# Altium schematic sheet pqm_v2_page1.SchDoc: Power Quality Monitor
size A4
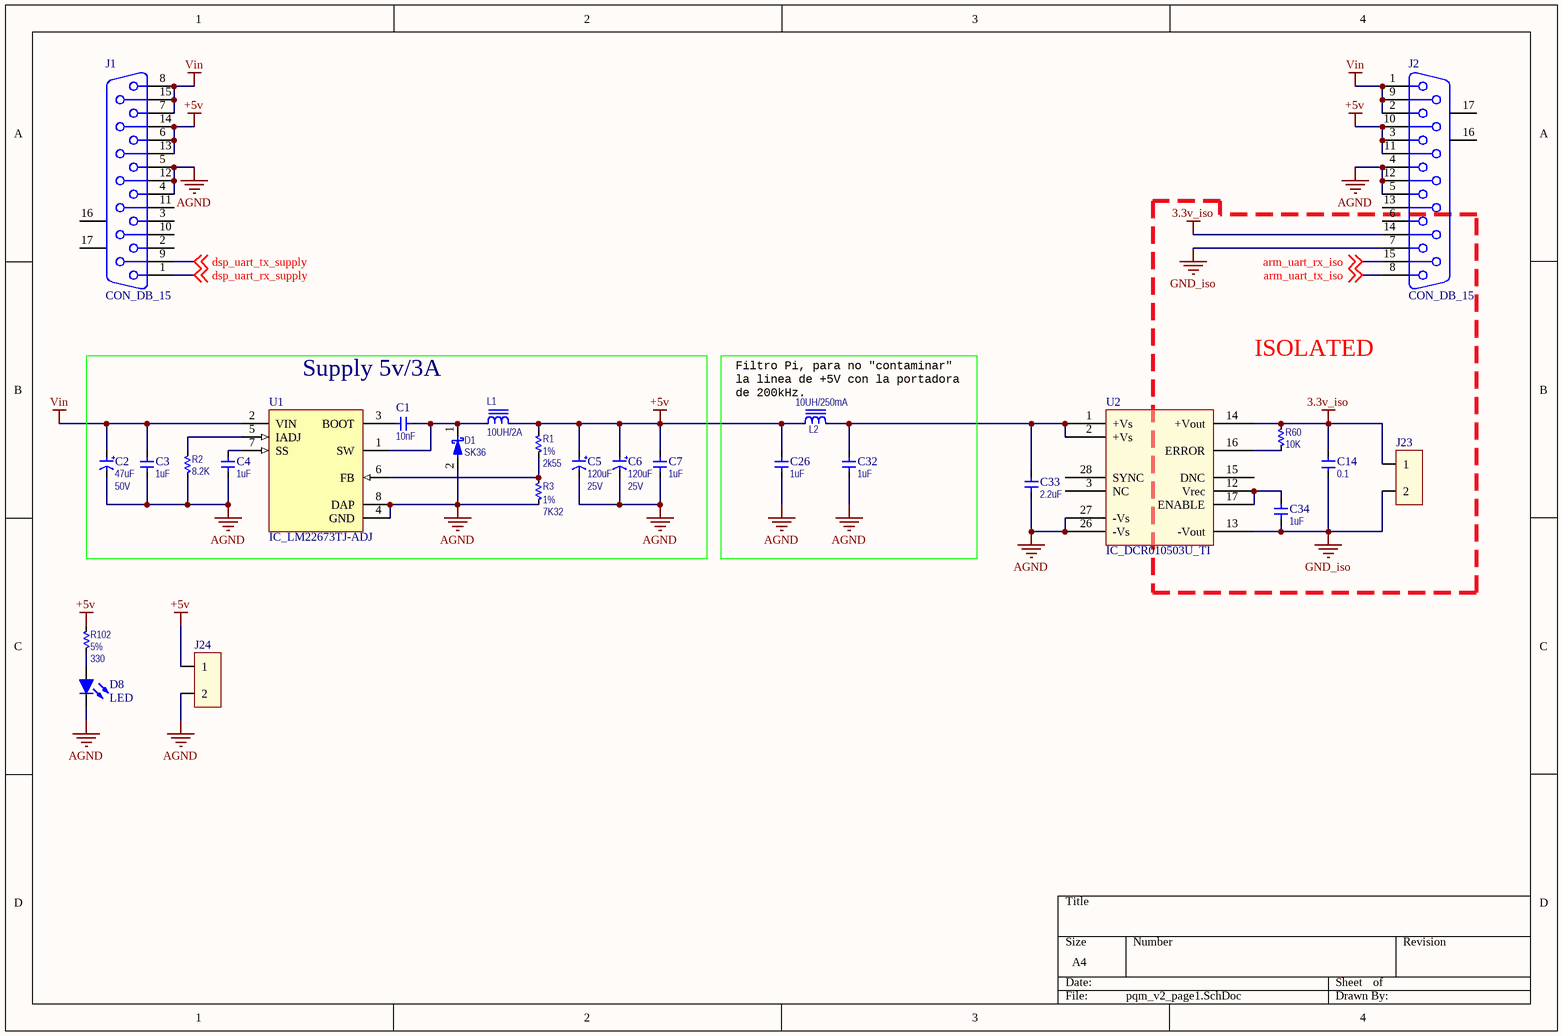
[diagram p0: pqm_v2_page1.SchDoc]

## Parts
C1  value 10nF  [CAPC3216X135N_B]  (hidden comment: CAP_C3216X7R2J103K115AA_TDK)
C2  value 47uF  Voltage Rating: 50V  [CAPAE630770X770N]  (hidden comment: CAP_EEE-1HA470XP_PANASONIC)
C3  value 1uF  [CAPC3216X135N_B]  (hidden comment: CAP_C3216X7R1E105M085AA_TDK)
C4  value 1uF  [CAPC3216X135N_B]  (hidden comment: CAP_C3216X7R1E105M085AA_TDK)
C5  value 120uF  Voltage Rating: 25V  [CAPPRD250W50D630H1250]  (hidden comment: CAP_ELXY250ELL121MF15D_UC)
C6  value 120uF  Voltage Rating: 25V  [CAPPRD250W50D630H1250]  (hidden comment: CAP_ELXY250ELL121MF15D_UC)
C7  value 1uF  [CAPC3216X135N_B]  (hidden comment: CAP_C3216X7R1E105M085AA_TDK)
C14  value 0.1  [CAPC2013X110N]  (hidden comment: CAP_CC0805KRX7R8BB104_YAGEO)
C26  value 1uF  [CAPC3216X135N_B]  (hidden comment: CAP_C3216X7R1E105M085AA_TDK)
C32  value 1uF  [CAPC3216X135N_B]  (hidden comment: CAP_C3216X7R1E105M085AA_TDK)
C33  value 2.2uF  [CAPC3216X135N_B]  (hidden comment: CAP_CC1206KKX7R7BB225_YAGEO)
C34  value 1uF  [CAPC2013X110N]  (hidden comment: CAP_CC0805KKX7R7BB105_YAGEO)
D1  value SK36  [DIOM7959X262N]  (hidden comment: DIO_SK36_MICROCOM)
D8  LED  [Led]
J1  CON_DB_15  [788757-1]
J2  CON_DB_15  [788757-1]
J23  CON_RADX2  [RAD2]  (value not drawn)
J24  CON_RADX2  [RAD2]  (value not drawn)
L1  value 10UH/2A  [MAG_INDUCTOR2A]  (hidden comment: MAG_SRR1005-100M_BOURNS)
L2  value 10UH/250mA  [INDC4532X170N]  (hidden comment: MAG_CM453232-100KLCT_BOURNS)
R1  value 2k55  Tolerance: 1%  [RESC3216N]  (hidden comment: RES_ERJ-8ENF2551V_Panasonic)
R2  value 8.2K  [RESC3216N]  (hidden comment: RES_ERJ-8GEYJ822V_Panasonic)
R3  value 7K32  Tolerance: 1%  [RESC3216N]  (hidden comment: RES_ERJ-8ENF7321V_Panasonic)
R60  value 10K  [RESC3216N]  (hidden comment: RES_RC1206FR-0710KL_Yageo)
R102  value 330  Tolerance: 5%  [RESC2013X065BN]  (hidden comment: RES_RC0805JR-07330RL_YAGEO)
U1  IC_LM22673TJ-ADJ  [TJ7A_N]
U2  IC_DCR010503U_TI  [SOP28]

## Blocks framed on the sheet
ISOLATED: C14 C34 J23 R60 U2
Supply 5v/3A: C1-C7 D1 L1 R1-R3 U1

## Nets
3.3v_iso: C14.1(T1) J2.14 J23.1 R60.2(T2) U2.14(+Vout)
+5v: C5.1 C6.1 C7.1(T1) C26.1(T1) J1.6 J1.13 J1.14 J2.3 J2.10 J2.11 J24.1 L1.2 L2.1 R1.1(T1) R102.2(T2)
AGND: C2.2 C3.2(T2) C4.2(T2) C5.2 C6.2 C7.2(T2) C26.2(T2) C32.2(T2) C33.2(T2) D1.2(A) D8.2(K) J1.4 J1.5 J1.12 J2.4 J2.5 J2.12 J24.2 R2.1(T1) R3.2(T2) U1.4(GND) U1.8(DAP) U2.26(-Vs) U2.27(-Vs)
GND_iso: C14.2(T2) C34.2(T2) J2.7 J23.2 U2.13(-Vout)
Vin: C2.1 C3.1(T1) J1.7 J1.8 J1.15 J2.1 J2.2 J2.9 U1.2(VIN)
arm_uart_rx_iso: J2.15 ; off-sheet arm_uart_rx_iso
arm_uart_tx_iso: J2.8 ; off-sheet arm_uart_tx_iso
dsp_uart_rx_supply: J1.1 ; off-sheet dsp_uart_rx_supply
dsp_uart_tx_supply: J1.9 ; off-sheet dsp_uart_tx_supply
NetC1_1: C1.1(T1) U1.3(BOOT)
NetC1_2: C1.2(T2) D1.1(K) L1.1 U1.1(SW)
NetC4_1: C4.1(T1) U1.7(SS)
NetC32_1: C32.1(T1) C33.1(T1) L2.2 U2.1(+Vs) U2.2(+Vs)
NetC34_1: C34.1(T1) U2.12(Vrec) U2.17(ENABLE)
NetD8_1: D8.1(A) R102.1(T1)
NetR1_2: R1.2(T2) R3.1(T1) U1.6(FB)
NetR2_2: R2.2(T2) U1.5(IADJ)
NetR60_1: R60.1(T1) U2.16(ERROR)

Not connected (* = marked no-connect by the designer): J1 2 3 10 11 16(MH1) 17(MH2); J2 6 13 16(MH1) 17(MH2); U2 3(NC) 15(DNC) 28(SYNC)

## Notes on the sheet
- (near L2) Filtro Pi, para no "contaminar" la linea de +5V con la portadora de 200kHz.

## Library data of the parts
C1 = CAP_C3216X7R2J103K115AA_TDK: 10000pF, 630 V, Capacitores cerámicos, X7R, 1206 (3216 métrico), 0.126" L x 0.063" A (3.20 mm x 1.60 mm); Manufacturer: TDK; Tolerance: 10%; Voltage Rating: 630 V; Supplier: *; Supplier Part No: *; Power Rating: *; BOM Populate: *; Digikey Part Number: 445-2291-1-ND; Mouser Part Number: 810-C3216X7R2J103K; Manufacturer Part Number: C3216X7R2J103K115AA
C2 = CAP_EEE-1HA470XP_PANASONIC: 47µF 50V Aluminum Capacitors Radial, Can - SMD 2000 Hrs @ 85°C; Tolerance: 20%; BOM Populate: *; Power Rating: *; Supplier Part No: *; Supplier: *; Manufacturer: Panasonic; Petra Part No: *; Digikey Part Number: PCE3929CT-ND; Mouser Part Number: 667-EEE-1HA470XP; Manufacturer Part Number: EEE-1HA470XP
C3 C4 C7 C26 C32 = CAP_C3216X7R1E105M085AA_TDK: 1 µF, 25 V, Capacitores cerámicos, X7R, 1206 (3216 métrico), 0.126" L x 0.063" A (3.20 mm x 1.60 mm); Manufacturer: TDK; Tolerance: 20%; Voltage Rating: 25V; Supplier: *; Supplier Part No: *; Power Rating: *; BOM Populate: *; Digikey Part Number: 445-4024-1-ND; Mouser Part Number: 810-C3216X7R1E105M-2; Manufacturer Part Number: C3216X7R1E105M085AA
C5 C6 = CAP_ELXY250ELL121MF15D_UC: CAP ALUM 120UF 20% 25V RADIAL; BOM Populate: *; Power Rating: *; Supplier Part No: *; Supplier: *; Digikey Part Number: 565-1791-ND; Tolerance: 20%; Petra Part No: *; Mouser Part Number: 661-ELXY250ELL121MF1; Manufacturer Part Number: ELXY250ELL121MF15D
C14 = CAP_CC0805KRX7R8BB104_YAGEO: CAP CER 0.1UF 25V 10% X7R 0805; Manufacturer: Yageo; Supplier: *; Tolerance: 10%; Power Rating: *; Voltage Rating: 25V; BOM Populate: *; Digikey Part Number: 311-1141-1-ND; Mouser Part Number: 603-CC805KRX7R8BB104; Manufacturer Part Number: CC0805KRX7R8BB104
C33 = CAP_CC1206KKX7R7BB225_YAGEO: CAP CER 2.2UF 16V X7R 1206; Manufacturer: YAGEO; Tolerance: 10%; Supplier: *; Supplier Part No: *; Power Rating: *; BOM Populate: *; Voltage Rating: 16V; Digikey Part Number: 311-1957-1-ND; Mouser Part Number: 603-CC126KKX7R7BB225; Manufacturer Part Number: CC1206KKX7R7BB225
C34 = CAP_CC0805KKX7R7BB105_YAGEO: CAP CER 1UF 16V X7R 0805; Manufacturer: YAGEO; Tolerance: 10%; Supplier: *; Supplier Part No: *; Power Rating: *; BOM Populate: *; Voltage Rating: 16V; Digikey Part Number: 311-1365-1-ND; Mouser Part Number: 603-CC805KKX7R7BB105; Manufacturer Part Number: CC0805KKX7R7BB105
D1 = DIO_SK36_MICROCOM: DIODE SCHOTTKY 60V 3A SMC; Manufacturer: Micro Commercial Co; Manufacturer Part Number: SK36-TP; BOM Populate: *; Voltage Rating: 60V; Supplier Part No: *; Supplier: *; Digikey Part Number: SK36-TPMSCT-ND; Tolerance: *; Power Rating: *; Mouser Part Number: 833-SK36-TP
D8 = LED0: Published: 8-Jun-2000; LatestRevisionDate: 08-Jul-2005; LatestRevisionNote: Mech Layer 1 removed.; PackageReference: LED-0; Publisher: Altium Limited
J1 J2 = 788781-1: Receptacle Assembly, 15 Position, Right Angle, 8.08mm Series, Amplimite, with Screwlocks; Positions: 15; MatingConnector: Female Screw Locks; PCB_Layout: Complies with manufacturer's recommendation.; DrillSize: Corresponds to nominal value.; Published: 15-Jun-2001; LatestRevisionDate: 17-Jul-2002; LatestRevisionNote: Re-released for DXP Platform.; DatasheetDocument: Sep-1999; PackageDocument: Sep-1999; PackageReference: 788781-1; Publisher: Altium Limited; Orientation: Right Angle; Gender: Receptacle; ShellSize: 2; ComponentLink1Description: Manufacturer Link; ComponentLink1URL: http://www.tycoelectronics.com/; ComponentLink2Description: Packaging Specification; ComponentLink2URL: http://ecommas.tycoelectronics.com/commerce/DocumentDelivery/DDEController?Action=showdoc&DocId=Customer+Drawing%7F788781%7FO%7Fpdf%7FEnglish%7FENG_CD_788781_O.pdf
L1 = MAG_SRR1005-100M_BOURNS: FIXED IND 10UH 2A 65 MOHM SMD; Manufacturer: Bourns Inc; BOM Populate: *; Current Rating: *; Supplier: *; Supplier Part No: *; Voltage Rating: *; Tolerance: *; Digikey Part Number: SRR1005-100MCT-ND; Manufacturer Part Number: SRR1005-100M; Mouser Part Number: 652-SRR1005-100M
L2 = MAG_CM453232-100KLCT_BOURNS: FIXED IND 10UH 2A 65 MOHM SMD; Manufacturer: Bourns Inc; BOM Populate: *; Current Rating: *; Supplier: *; Supplier Part No: *; Voltage Rating: *; Tolerance: *; Digikey Part Number: CM453232-100KLCT-ND; Manufacturer Part Number: CM453232-100KL; Mouser Part Number: 652-CM453232-100KL
R1 = RES_ERJ-8ENF2551V_Panasonic: RES SMD 2.55K OHM 1% 1/4W 1206; BOM Populate: *; Supplier Part No: *; Supplier: *; Manufacturer: Panasonic; Digikey Part Number: P2.55KFCT-ND; Power Rating: 1/4W; Manufacturer Part Number: ERJ-8ENF2551V; Mouser Part Number: 667-ERJ-8ENF2551V
R2 = RES_ERJ-8GEYJ822V_Panasonic: RES SMD 8.2K OHM 5% 1/4W 1206; BOM Populate: *; Supplier Part No: *; Supplier: *; Tolerance: 5%; Manufacturer: Panasonic; Digikey Part Number: P8.2KECT-ND; Power Rating: 1/4W; Manufacturer Part Number: ERJ-8GEYJ822V; Mouser Part Number: 667-ERJ-8GEYJ822V
R3 = RES_ERJ-8ENF7321V_Panasonic: RES SMD 7.32K OHM 1% 1/4W 1206; BOM Populate: *; Supplier Part No: *; Supplier: *; Manufacturer: Panasonic; Digikey Part Number: P7.32KFCT-ND; Power Rating: 1/4W; Manufacturer Part Number: ERJ-8ENF7321V; Mouser Part Number: 667-ERJ-8ENF7321V
R60 = RES_RC1206FR-0710KL_Yageo: RES SMD 10K OHM 1% 1/4W 1206; Manufacturer: Yageo; BOM Populate: *; Supplier Part No: *; Supplier: *; Tolerance: 1%; Digikey Part Number: 311-10.0KFRCT-ND; Power Rating: 1/4W; Manufacturer Part Number: RC1206FR-0710KL; Mouser Part Number: 603-RC1206FR-0710KL
R102 = RES_RC0805JR-07330RL_YAGEO: RES SMD 330 OHM 5% 1/8W 0805; Manufacturer: Yageo; BOM Populate: *; Supplier Part No: *; Supplier: *; Digikey Part Number: 311-330ARCT-ND; Power Rating: 1/8W; Manufacturer Part Number: RC0805JR-07330RL; Mouser Part Number: 603-RC0805JR-07330RL
U1 = IC_LM22673TJ-ADJ: 3A SIMPLE SWITCHER® Step-Down Voltage Regulator with Adjustable Soft-Start and Current Limit, 7-pin TO-263 Thin; Manufacturer Part Number: LM22673TJ-ADJ/NOPB; Digikey Part Number: LM22673TJ-ADJ/NOPBCT-ND; Mouser Part Number: 926-LM22673TJADJNOPB
U2 = IC_DCR010503U_TI: IC REG ISOLATED 3.3V 0.3A 12SOP; Digikey Part Number: 296-9450-5-ND; Mouser Part Number: 595-DCR010503U; Manufacturer Part Number: DCR010503U